# EAGLE design Tension-Logger Rev. A (EAGLE 9.6.2)
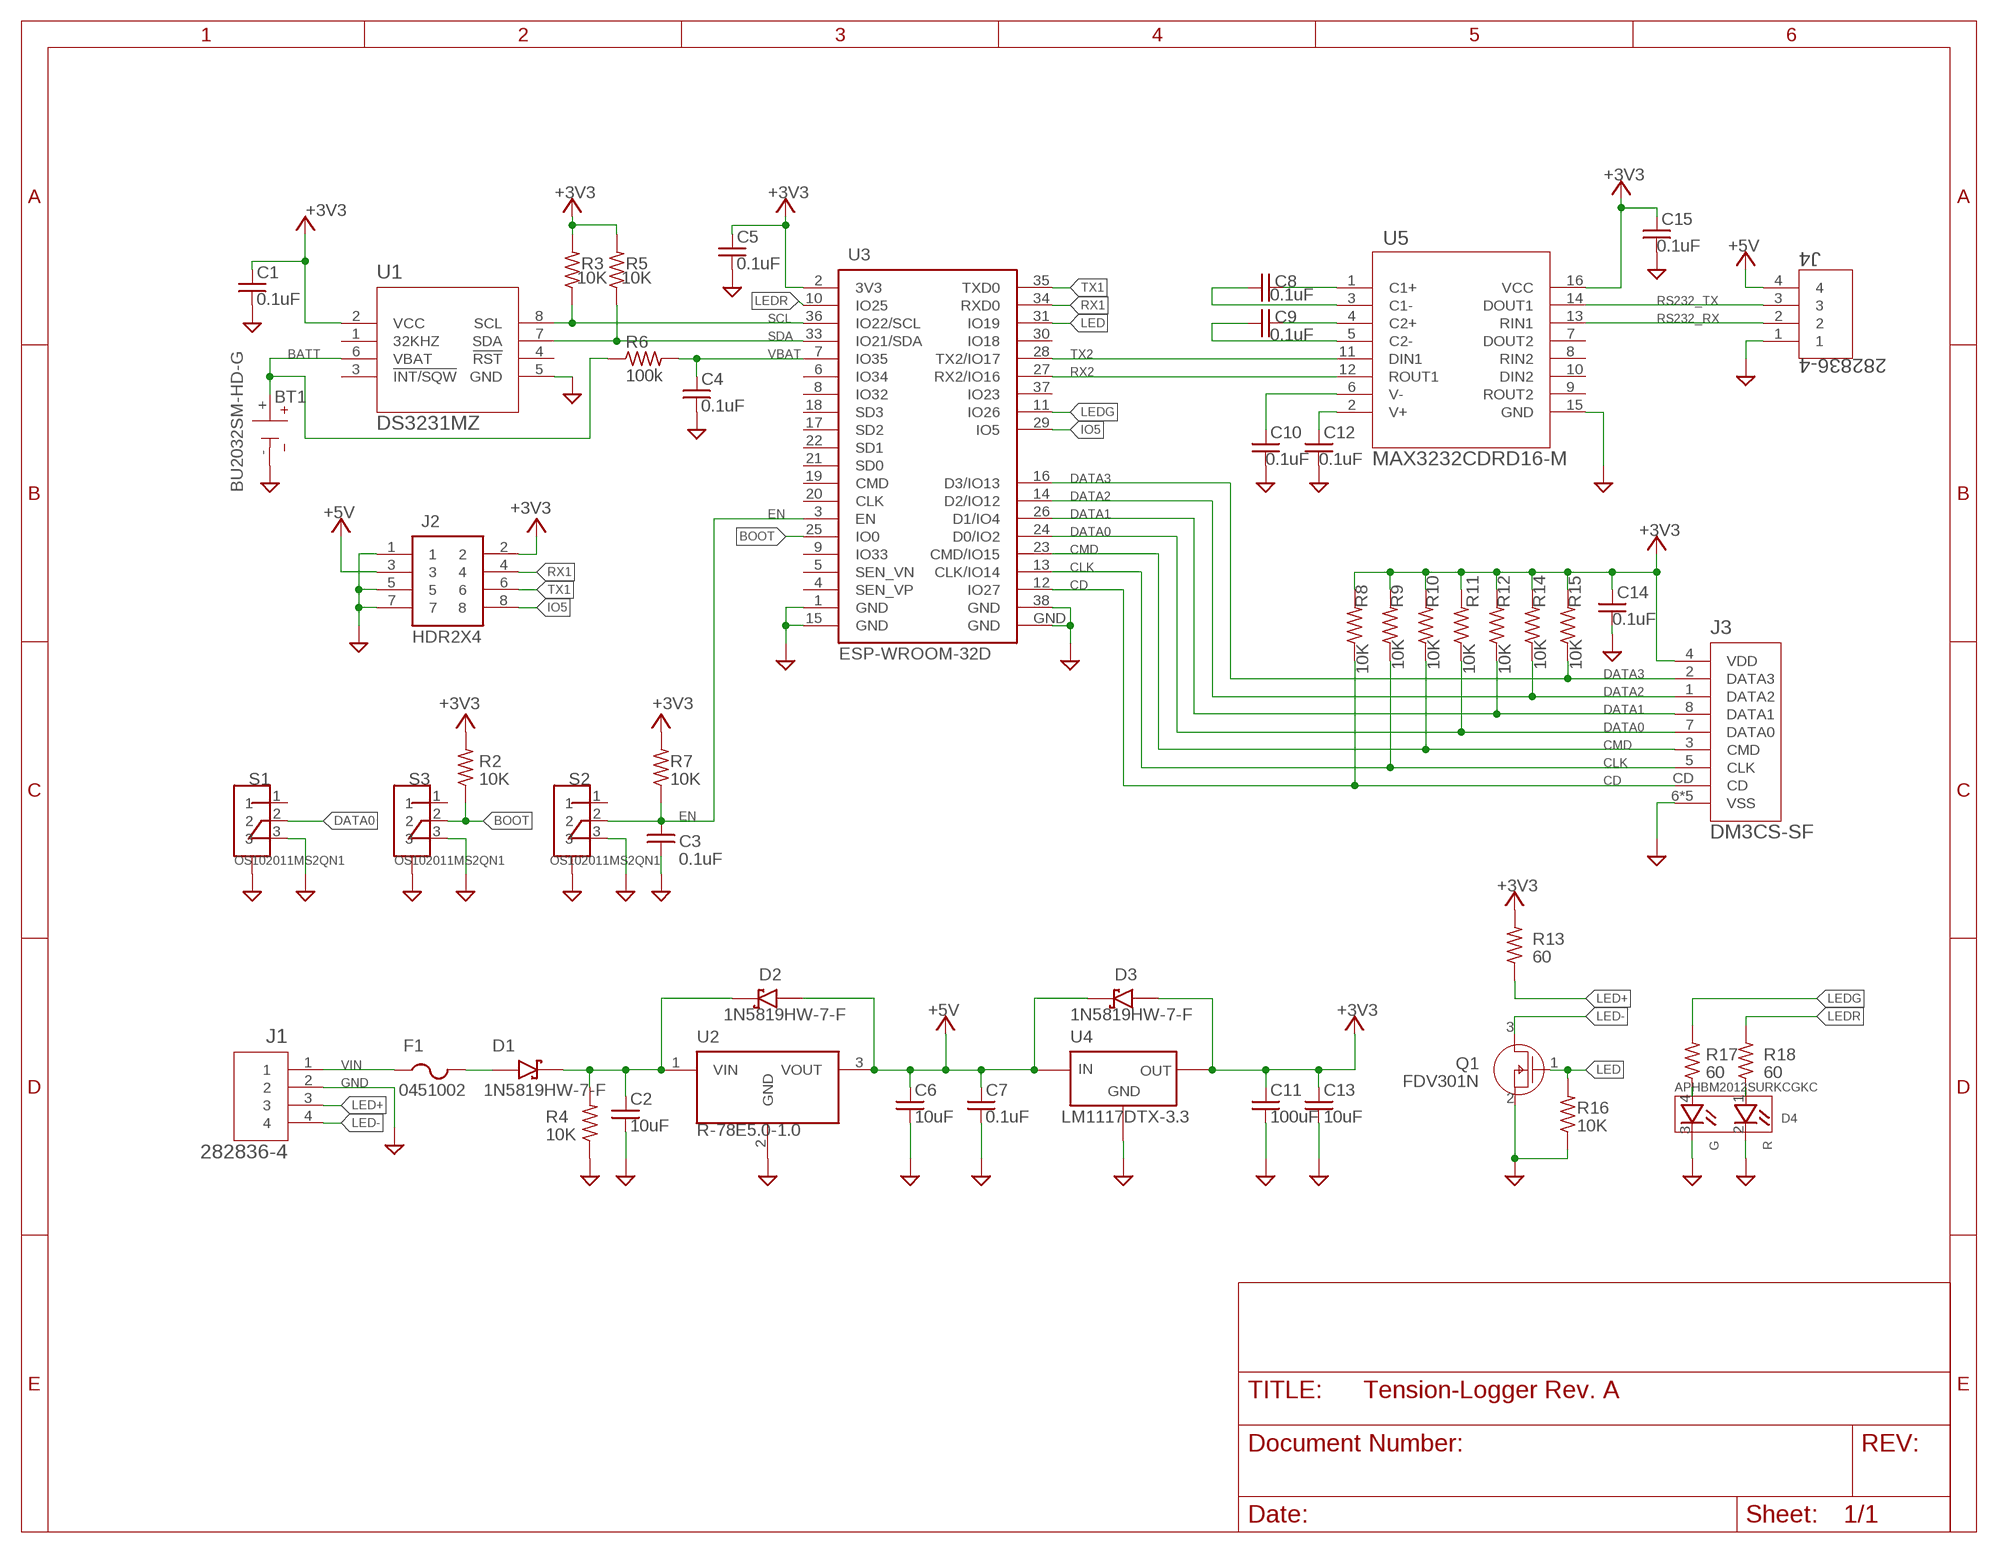
[diagram p0: schematic, sheet 1]

## Parts
BT1  BU2032SM-HD-G  [BAT_BU2032SM-HD-G]
C1  0.1uF  C0805  [0805]
C2  10uF  C0805  [0805]
C3  0.1uF  C0805  [0805]
C4  0.1uF  C0805  [0805]
C5  0.1uF  C0805  [0805]
C6  10uF  C0805  [0805]
C7  0.1uF  C0805  [0805]
C8  0.1uF  C0805  [0805]
C9  0.1uF  C0805  [0805]
C10  0.1uF  C0805  [0805]
C11  100uF  C1210  [1210]
C12  0.1uF  C0805  [0805]
C13  10uF  C1210  [1210]
C14  0.1uF  C0805  [0805]
C15  0.1uF  C0805  [0805]
D1  1N5819HW-7-F  [SOD3715X145N]
D2  1N5819HW-7-F  [SOD3715X145N]
D3  1N5819HW-7-F  [SOD3715X145N]
D4  APHBM2012SURKCGKC  [LED_APHBM2012SURKCGKC]
F1  0451002  0451002_MRL6.1_2.69_2.69MM  [FUSC6131X270]
J1  282836-4  [282836-4_TYC]
J2  HDR2X4  [HDR2X4]
J3  DM3CS-SF  [CONN_3CS-SF]
J4  282836-4  [282836-4_TYC]
Q1  FDV301N  [SOT23-3_ONS]
R2  10K  R-US_R0805  [R0805]
R3  10K  R-US_R0805  [R0805]
R4  10K  R-US_R0805  [R0805]
R5  10K  R-US_R0805  [R0805]
R6  100k  R-US_R0805  [R0805]
R7  10K  R-US_R0805  [R0805]
R8  10K  R-US_R0805  [R0805]
R9  10K  R-US_R0805  [R0805]
R10  10K  R-US_R0805  [R0805]
R11  10K  R-US_R0805  [R0805]
R12  10K  R-US_R0805  [R0805]
R13  60  R-US_R0805  [R0805]
R14  10K  R-US_R0805  [R0805]
R15  10K  R-US_R0805  [R0805]
R16  10K  R-US_R0805  [R0805]
R17  60  R-US_R0805  [R0805]
R18  60  R-US_R0805  [R0805]
S1  OS102011MS2QN1  [SW_OS102011MS2QN1]
S2  OS102011MS2QN1  [SW_OS102011MS2QN1]
S3  OS102011MS2QN1  [SW_OS102011MS2QN1]
U1  DS3231MZ  DS3231MZ+21-0041B_8_MXM-M  [21-0041B_8_MXM-M]
U2  R-78E5.0-1.0  [CONV_R-78E5.0-1.0]
U3  ESP-WROOM-32D  ESP-WROOM-32  [ESP-WROOM-32]
U4  LM1117DTX-3.3  [TO252]
U5  MAX3232CDRD16-M  [D16-M]

## Nets
+3V3: C1.B C5.B C11.A C13.A C14.A C15.B D3.A J2.2 J3.4(VDD) R2.2 R3.2 R5.2 R7.2 R8.2 R9.2 R10.2 R11.2 R12.2 R13.2 R14.2 R15.2 U1.2(VCC) U3.2(3V3) U4.TAB(OUT) U5.16(VCC)
+5V: C6.A C7.A D2.A D3.C(K) J2.3 J4.4 U2.3(VOUT) U4.2(IN)
BATT: BT1.+ R6.1 U1.6(VBAT)
BOOT: R2.1 S3.2 U3.25(IO0)
CD: J3.CD R8.1 U3.12(IO27)
CLK: J3.5(CLK) R9.1 U3.13(CLK/IO14)
CMD: J3.3(CMD) R10.1 U3.23(CMD/IO15)
DATA0: J3.7(DATA0) R11.1 S1.2 U3.24(D0/IO2)
DATA1: J3.8(DATA1) R12.1 U3.26(D1/IO4)
DATA2: J3.1(DATA2) R14.1 U3.14(D2/IO12)
DATA3: J3.2(DATA3) R15.1 U3.16(D3/IO13)
EN: C3.B R7.1 S2.2 U3.3(EN)
GND: BT1.- C1.A C2.B C3.A C4.A C5.A C6.B C7.B C10.B C11.B C12.B C13.B C14.B C15.A D4.2(C_R) D4.3(C_G) J1.2 J2.1 J2.5 J2.7 J3.6(VSS) J3.GND-1(VSS) J3.GND-2(VSS) J3.GND-3(VSS) J3.GND-4(VSS) J4.1 Q1.2(S) R4.1 R16.1 S1.3 S1.M1(CASE) S1.M2(CASE) S2.3 S2.M1(CASE) S2.M2(CASE) S3.3 S3.M1(CASE) S3.M2(CASE) U1.5(GND) U2.2(GND) U3.1(GND) U3.15(GND) U3.38(GND) U3.GND U4.1(GND) U5.15(GND)
IO5: J2.8 U3.29(IO5)
LED: Q1.1(G) R16.2 U3.31(IO19)
LED+: J1.3 R13.1
LED-: J1.4 Q1.3(D)
LEDG: R17.2 U3.11(IO26)
LEDR: R18.2 U3.10(IO25)
N$1: D1.A F1.2
N$3: D4.1(A_R) R18.1
N$5: C2.A D1.C(K) D2.C(K) R4.2 U2.1(VIN)
N$6: D4.4(A_G) R17.1
N$9: C8.B U5.1(C1+)
N$10: C8.A U5.3(C1-)
N$11: C9.B U5.4(C2+)
N$12: C9.A U5.5(C2-)
N$13: C12.A U5.2(V+)
N$14: C10.A U5.6(V-)
RS232_RX: J4.2 U5.13(RIN1)
RS232_TX: J4.3 U5.14(DOUT1)
RX1: J2.4 U3.34(RXD0)
RX2: U3.27(RX2/IO16) U5.12(ROUT1)
SCL: R3.1 U1.8(SCL) U3.36(IO22/SCL)
SDA: R5.1 U1.7(SDA) U3.33(IO21/SDA)
TX1: J2.6 U3.35(TXD0)
TX2: U3.28(TX2/IO17) U5.11(DIN1)
VBAT: C4.B R6.2 U3.7(IO35)
VIN: F1.1 J1.1
Unconnected: S1.1 S2.1 S3.1 U1.1(32KHZ) U1.3(!INT/SQW) U1.4(!RST) U3.4(SEN_VP) U3.5(SEN_VN) U3.6(IO34) U3.8(IO32) U3.9(IO33) U3.17(SD2) U3.18(SD3) U3.19(CMD) U3.20(CLK) U3.21(SD0) U3.22(SD1) U3.30(IO18) U3.37(IO23) U5.7(DOUT2) U5.8(RIN2) U5.9(ROUT2) U5.10(DIN2)

## Library data of the parts
BT1 = Underwater-Camera-v2.0:BU2032SM-HD-G: Batt Holder Smt Coin 20mm Tape Check prices <https://pricing.snapeda.com/search/part/BU2032SM-HD-G/?ref=eda>; AVAILABILITY: Warning; DESCRIPTION: BATTERY HOLDER COIN 20MM SMD; MF: MPD (Memory Protection Devices); MP: BU2032SM-HD-G; PACKAGE: None; PRICE: None; PURCHASE-URL: https://pricing.snapeda.com/search/part/BU2032SM-HD-G/?ref=eda
C1-C15 = waterspider:C
D1-D3 = Underwater-Camera-v2.0:1N5819HW-7-F: 1N5819HW Series 40 V 1 A Surface Mount Schottky Barrier Rectifier - SOD-123; DESCRIPTION: Diode Schottky 40V 1A Surface Mount SOD-123; DIGI-KEY_PART_NUMBER: 1N5819HW-FDICT-ND; MF: Diodes Inc.; MP: 1N5819HW-7-F; PACKAGE: SOD-123 Diodes Inc.; PURCHASE-URL: https://pricing.snapeda.com/search/part/1N5819HW-7-F/?ref=eda
D4 = Underwater-Camera-v2.0:APHBM2012SURKCGKC: Green, Red 570nm Green, 630nm Red LED Indication - Discrete 2.1V Green, 1.95V Red 0805 (2012 Metric); DESCRIPTION: Green, Red 570nm Green, 630nm Red LED Indication - Discrete 2.1V Green, 1.95V Red 0805 (2012 Metric); DIGI-KEY_PART_NUMBER: 754-1093-1-ND; MF: Kingbright; MP: APHBM2012SURKCGKC; PACKAGE: 0805 Kingbright; PURCHASE-URL: https://pricing.snapeda.com/search/part/APHBM2012SURKCGKC/?ref=eda
F1 = Underwater-Camera-v2.0:0451002_MRL: 0451002.MRL - Littelfuse Inc.- FUSE BOARD MNT 2A 125VAC/VDC SMD
J1 J4 = Underwater-Camera-v2.0:282836-4; BUILT_BY: EMA_UL_Team; MANUFACTURER_PART_NUMBER: 282836-4; SOURCELIBRARY: Tyco_2012-04-26; VENDOR: TE Connectivity
J2 = Underwater-Camera-v2.0:HDR2X4
J3 = Underwater-Camera-v2.0:DM3CS-SF; BUILT_BY: EMA_Matt; COPYRIGHT: Copyright (C) 2018 Accelerated Designs. All rights reserved; MANUFACTURER_PART_NUMBER: DM3CS-SF; SOURCELIBRARY: Hirose_12_20_2019; VENDOR: Hirose
Q1 = Underwater-Camera-v2.0:FDV301N; BUILT_BY: EMA_Jessica; COPYRIGHT: Copyright (C) 2018 Accelerated Designs. All rights reserved; MANUFACTURER_PART_NUMBER: FDV301N; SOURCELIBRARY: ON_Semiconductor_2019-12-30; VENDOR: ON Semiconductor
R2-R18 = waterspider:R-US_: RESISTOR, American symbol
S1-S3 = Underwater-Camera-v2.0:OS102011MS2QN1: Switch Slide ON ON SPDT Top Slide 0.1A 12VDC 10000Cycles PC Pins Thru-Hole Bulk; DESCRIPTION: SLIDE SWITCH SPDT T/H ON-ON BBM; DIGI-KEY_PART_NUMBER: CKN12284-ND; MF: C&K; MP: OS102011MS2QN1; PACKAGE: None; PURCHASE-URL: https://pricing.snapeda.com/search/part/OS102011MS2QN1/?ref=eda
U1 = Underwater-Camera-v2.0:DS3231MZ+; BUILT_BY: EMA_UL_Team; MANUFACTURER_PART_NUMBER: DS3231MZ+; SOURCELIBRARY: Maxim_2014-05-21; VENDOR: Maxim Integrated Products
U2 = Underwater-Camera-v2.0:R-78E5.0-1.0: 1.0 Amp SIP3 Single Output; DESCRIPTION: 1A DC/DC-Converter 'INNOLINE' SIP3 reg; DIGI-KEY_PART_NUMBER: 945-2201-ND; MF: Recom Power; MP: R-78E5.0-1.0; PACKAGE: SIP-3 Recom Power; PURCHASE-URL: https://pricing.snapeda.com/search/part/R-78E5.0-1.0/?ref=eda
U3 = Underwater-Camera-v2.0:ESP-WROOM-32: Espressif Systems ESP-WROOM-32
U4 = Underwater-Camera-v2.0:LM1117DTX-*
U5 = Underwater-Camera-v2.0:MAX3232CDR; BUILT_BY: EMA_UL_Team; MANUFACTURER_PART_NUMBER: MAX3232CDR; VENDOR: Texas Instruments

## Board
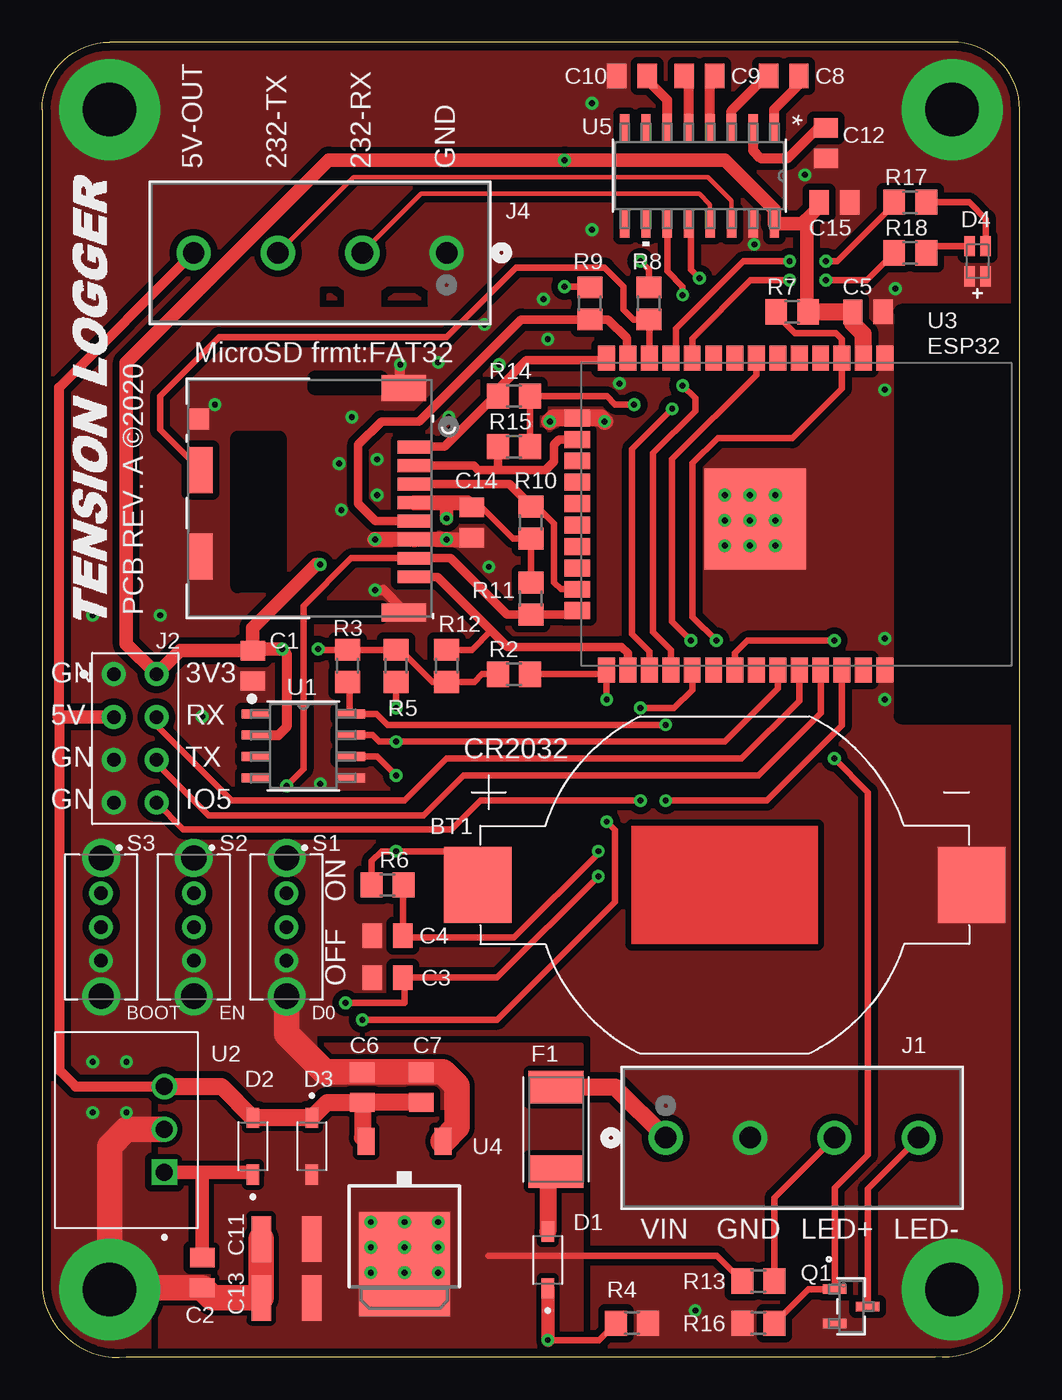
[diagram p1: board, top side]
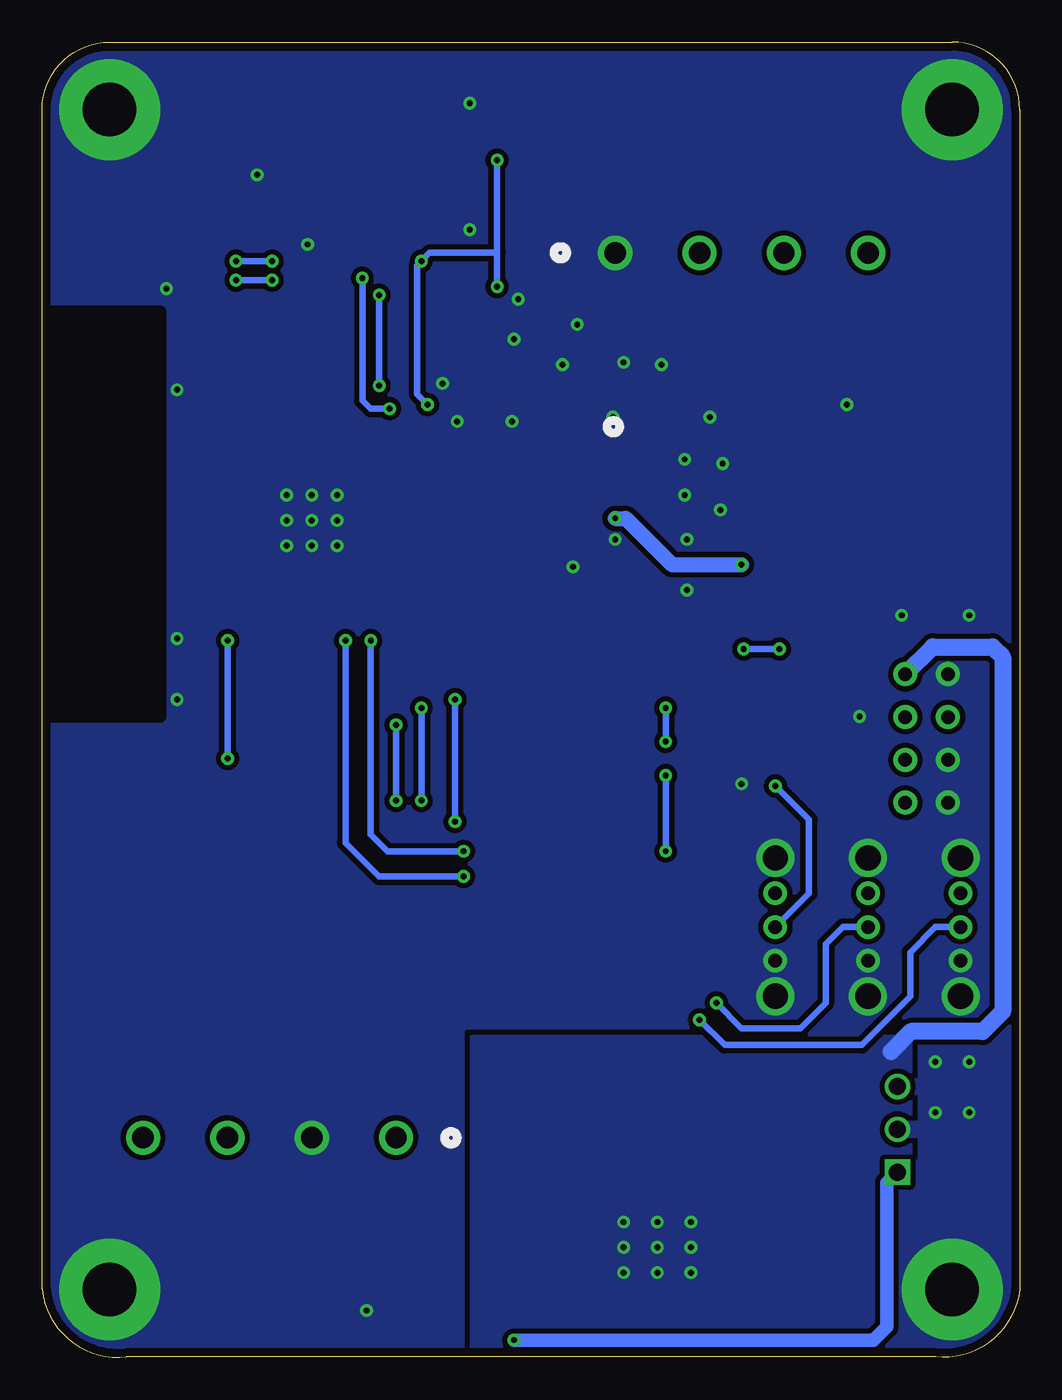
[diagram p2: board, bottom side, seen from below]

Size 58 x 78.03 mm. Coordinates in mm from the lower left corner, seen from the top.
Outline: 54,78.03 4,78.03 arc90 0,74.03 0,4.03 arc90 5,0.03 53,0.03 arc90 58,4.03 58,74.03 arc90 54,78.03
Copper layers (1*16): Top 0.035mm / dielectric 1.5mm / Bottom 0.035mm
Design rules "default *": minimum track width 10mil, minimum drill 0.35mm, track to track 10mil, track to pad 10mil, pad to pad 10mil, via to via 10mil, smd to smd 10mil, copper to edge 20mil, drill to drill 10mil, minimum pad ring 10mil, minimum via ring 8mil, stop-mask expansion 4mil, vias tented up to drill 0.4mm, thermal gap 10mil
tRestrict: area 51,38 to 59.5,62
bRestrict: area 51,38 to 60.5,62

### Footprints (pad centres in the part's own frame; a part is rotated, then mirrored left to right if it is on the bottom)
BAT_BU2032SM-HD-G = smd 4 x 4.5: + -14.65,0; - 14.65,0
0805 = smd 1.15 x 1.45: A -0.9,0; B 0.9,0
1210 = smd 1.15 x 2.7: A -1.5,0; B 1.5,0
SOD3715X145N = smd 1.21 x 0.73: A 1.68,0; C -1.68,0
LED_APHBM2012SURKCGKC = smd 1.2 x 0.6: 1 0.9,0.475; 2 -0.9,0.475; 3 -0.9,-0.475; 4 0.9,-0.475
FUSC6131X270 = smd 1.929 x 3.262: 1 -2.5,0; 2 2.5,0
282836-4_TYC = drill 1.27 pad 2.032: 1 0,0; 2 5.004,0; 3 10.008,0; 4 15.011,0
HDR2X4 = drill 0.8 pad 1.422: 1 0,0; 2 0,2.54; 3 2.54,0; 4 2.54,2.54; 5 5.08,0; 6 5.08,2.54; 7 7.62,0; 8 7.62,2.54
CONN_3CS-SF = smd 0.762 x 2.007: 1 3.041,-6.198; 2 1.941,-6.198; 3 0.841,-6.198; 4 -0.259,-6.198; 5 -1.359,-6.198; 6 -2.459,-6.198; 7 -3.559,-6.198; 8 -4.659,-6.198 | smd 2.743 x 1.448: CD 1.669,6.477; GND-2 -3.459,6.477 | smd 1.041 x 2.642: GND-1 -6.779,-5.578 | smd 1.245 x 1.245: GND-3 4.691,6.579 | smd 1.549 x 2.642: GND-4 6.526,-5.578
SOT23-3_ONS = smd 0.559 x 1.397: 1 -1.016,-0.978; 2 1.016,-0.978; 3 0,0.978
R0805 = smd 1.3 x 1.5: 1 -0.95,0; 2 0.95,0
SW_OS102011MS2QN1 = drill 0.8 pad 1.4: 1 -2,0; 2 0,0; 3 2,0 | drill 1.5 pad 2: M1 -4.1,0; M2 4.1,0
21-0041B_8_MXM-M = smd 1.664 x 0.533: 1 -2.826,1.905; 2 -2.826,0.635; 3 -2.826,-0.635; 4 -2.826,-1.905; 5 2.826,-1.905; 6 2.826,-0.635; 7 2.826,0.635; 8 2.826,1.905
CONV_R-78E5.0-1.0 = drill 1 square: 1 -2.54,-2.25 | drill 1: 2 0,-2.25; 3 2.54,-2.25
ESP-WROOM-32 = smd 1.5 x 1: 1 -9.25,7; 2 -9.25,5.73; 3 -9.25,4.46; 4 -9.25,3.19; 5 -9.25,1.92; 6 -9.25,0.65; 7 -9.25,-0.62; 8 -9.25,-1.89; 9 -9.25,-3.16; 10 -9.25,-4.43; 11 -9.25,-5.7; 12 -9.25,-6.97; 13 -9.25,-8.24; 14 -9.25,-9.51; 25 9.25,-9.51; 26 9.25,-8.24; 27 9.25,-6.97; 28 9.25,-5.7; 29 9.25,-4.43; 30 9.25,-3.16; 31 9.25,-1.89; 32 9.25,-0.62; 33 9.25,0.65; 34 9.25,1.92; 35 9.25,3.19; 36 9.25,4.46; 37 9.25,5.73; 38 9.25,7 | smd 1 x 1.5: 15 -5.7,-11.25; 16 -4.43,-11.25; 17 -3.16,-11.25; 18 -1.89,-11.25; 19 -0.62,-11.25; 20 0.65,-11.25; 21 1.92,-11.25; 22 3.19,-11.25; 23 4.46,-11.25; 24 5.73,-11.25 | smd 6 x 6: GND 0.3,-0.7
TO252 = smd 1 x 1.6: 1 -2.28,-4.8; 2 2.28,-4.8 | smd 5.4 x 6.2: TAB 0,2.5
D16-M = smd 1.664 x 0.559: 1 -2.826,4.445; 2 -2.826,3.175; 3 -2.826,1.905; 4 -2.826,0.635; 5 -2.826,-0.635; 6 -2.826,-1.905; 7 -2.826,-3.175; 8 -2.826,-4.445; 9 2.826,-4.445; 10 2.826,-3.175; 11 2.826,-1.905; 12 2.826,-0.635; 13 2.826,0.635; 14 2.826,1.905; 15 2.826,3.175; 16 2.826,4.445

### Placement (x,y rotation side)
BT1  40.5,28.03 0 top
C1  12.5,41.03 90 top
C2  9.5,5.03 270 top
C3  20.5,22.53 0 top
C4  20.5,25.03 0 top
C5  49,62.03 180 top
C6  19,16.03 90 top
C7  22.5,16.03 90 top
C8  44,76.03 0 top
C9  39,76.03 0 top
C10  35,76.03 180 top
C11  14.5,7.03 180 top
C12  46.5,72.03 270 top
C13  14.5,3.53 180 top
C14  25.5,49.53 270 top
C15  47,68.53 180 top
D1  30,5.78 90 top
D2  12.5,12.53 90 top
D3  16,12.53 270 top
D4  55.5,65.03 90 top
F1  30.5,13.53 270 top
J1  37,13.03 0 top
J2  4.25,40.53 270 top
J3  15.88,50.97 90 top
J4  24,65.53 180 top
Q1  48,3.03 270 top
R2  28,40.53 180 top
R3  18.12,41.03 90 top
R4  35,2.03 180 top
R5  21,41.03 90 top
R6  20.5,28.03 0 top
R7  44.5,62.03 0 top
R8  36,62.53 90 top
R9  32.5,62.53 90 top
R10  29,49.53 270 top
R11  29,45.03 90 top
R12  24,41.03 270 top
R13  42.5,4.53 180 top
R14  28,57.03 0 top
R15  28,54.03 0 top
R16  42.5,2.03 0 top
R17  51.5,68.53 180 top
R18  51.5,65.53 180 top
S1  14.5,25.53 270 top
S2  9,25.53 270 top
S3  3.5,25.53 270 top
U1  15.5,36.28 0 top
U2  5,13.53 90 top
U3  43,50.03 270 top
U4  21.5,8.03 180 top
U5  39,70.1 270 top

### Tracks (layer width: path | path; a pad name or v marks a point on that pad's centre or on a via)
+3V3  (via drill 0.35)
  Top 0.4: R15.2 R14.2 33.5,57.03 34,56.53 v35.12,56.53 | R11.2 R10.2 27.95,48.58 26.1,50.43 C14.A | R9.2 32.45,63.53 v31,63.53 | R8.2 36,64.53 v35.5,65.03 | R2.2 26.09,40.53 25.64,40.08 R12.2 23.17,40.08 21.27,41.98 R5.2 R3.2 16.43,41.98 v16.38,42.03 | R13.2 40.05,6.03 26.5,6.03
  Top 0.6: U1.2 14.02,36.91 14.51,37.4 14.51,41.77 v14.25,42.03
  Top 0.8: 25.22,50.71 C14.A | v24,49.78 24,50.71 | C15.B 46.1,68.24 45.38,67.52 | 45.38,67.52 45.13,67.27 U5.16 43.45,68.08 40.5,71.03 v31,71.03 17,71.03 5,59.03 5,42.32 J2.2 8.19,41.93 C1.B | R7.2 45.38,62.1 45.38,67.52 | v16.5,47.03 16.25,47.03 12.5,43.28 C1.B | C1.B 12.6,42.03 v14.25,42.03
  Top 0.9: J3.4 24,50.71 25.22,50.71
  Top 1: U3.2 48.71,59.29 48.71,60.71 48.1,61.33 C5.B R7.2
  Bottom 0.4: v16.38,42.03 v14.25,42.03 | v31,63.53 31,65.53 | 31,65.53 v31,71.03 | 31,65.53 35,65.53 v35.5,65.03 35.75,64.78 35.75,57.15 v35.12,56.53
  Bottom 0.9: v24,49.78 23.38,49.78 20.62,47.03 v16.5,47.03
  Bottom 1: J2.2 5.16,42.15 1.62,42.15 1.01,41.53 1.01,20.52 2.2,19.32 6.45,19.32 7.62,18.15
  other vias: 23.5,5.03 21.5,5.03 19.5,5.03 19.5,8.03 19.5,6.53 21.5,8.03 21.5,6.53 23.5,6.53 23.5,8.03
  pour Top (isolate 0.3, no thermals): 32,-0.97 32,18.53 7,18.53 7,-0.97
  pour Bottom (isolate 0.3): 6.5,-1.47 6.5,19.03 32.5,19.03 32.5,-1.47
+5V
  Top 0.6: J4.4 1,57.54 1,38.03 1,17.05 1.99,16.07 U2.3
  Top 0.8: J2.3 1.04,37.99 1,38.03
  Top 1: U2.3 10.64,16.07 D2.A D3.C 16.92,15.13 C6.A | U4.2 19,13.05 C6.A | C7.A C6.A
BATT  (via drill 0.35)
  Top 0.4: v21,34.53 19.88,35.64 U1.6 | BT1.+ 25.85,29.28 25.1,30.03 v21,30.03 20.12,30.03 19.55,29.45 R6.1
  Bottom 0.4: v21,34.53 v21,30.03
BOOT  (via drill 0.35)
  Top 0.4: R2.1 33.24,40.53 U3.25 v33.49,39.04 v33.5,39.03 | v19,20.03 27,20.03 34,27.03 34,31.28 v33.5,31.78
  Bottom 0.4: S3.2 5,25.53 6.5,24.03 6.5,21.4 9.38,18.53 17.5,18.53 v19,20.03 | v33.5,31.78 v33.5,39.03
CD
  Top 0.4: J3.CD 7,55.04 7,57.03 10.5,60.53 24,60.53 28.12,64.65 33.38,64.65 34.5,63.53 34.5,62.15 35.08,61.58 R8.1 36.03,61.55 U3.12
CLK
  Top 0.5: J3.5 19.79,49.61 18.75,50.65 18.75,54.15 20.12,55.53 22.38,55.53 28.43,61.58 R9.1 33.58,61.58 34.69,60.46 34.69,59.34 U3.13
CMD
  Top 0.4: U3.23 30.79,45.57 30.38,45.98 30.38,49.48 29.38,50.48 R10.1
  Top 0.5: J3.3 27.72,51.81 29,50.53 R10.1
DATA0  (via drill 0.35)
  Top 0.4: J3.7 18.34,47.41 15.5,44.57 15.5,34.9 v14.5,33.9
  Top 0.5: J3.7 24.24,47.41 27.57,44.08 R11.1 31.28,44.08 31.5,44.3 U3.24
  Bottom 0.4: S1.2 12.5,27.53 12.5,31.9 v14.5,33.9
DATA1
  Top 0.4: 26.64,43.12 25.5,41.98 R12.1
  Top 0.5: J3.8 23.45,46.31 26.64,43.12 27.6,42.15 34.38,42.15 34.76,41.77 U3.26
DATA2
  Top 0.5: J3.1 22.1,54.03 23.88,54.03 26.88,57.03 R14.1 27.05,57.45 28.75,59.15 33.49,59.15 U3.14
DATA3
  Top 0.5: J3.2 25.62,52.91 25.88,52.65 27.12,52.65 | U3.16 30.68,54.46 30.38,54.15 30.38,53.15 29.88,52.65 27.12,52.65 | R15.1 27.05,52.73 27.12,52.65
EN  (via drill 0.35)
  Top 0.4: R7.1 43.55,61.88 44.66,60.78 47.08,60.78 47.46,60.4 U3.3 47.46,57.49 44.5,54.53 40.08,54.53 38.6,53.04 38.6,43.93 v40,42.53 | v33,28.53 27,22.53 21.5,22.53 | 21.5,22.53 C3.B | v18,21.03 21.5,21.03 21.5,22.53
  Bottom 0.4: v40,42.53 40,30.53 38,28.53 v33,28.53 | S2.2 10.5,25.53 11.5,24.53 11.5,21.03 13,19.53 16.5,19.53 v18,21.03
GND  (via drill 0.35, 3.17 pad 6)
  Top 0.6: J3.GND-4 21.25,57.7 v21.25,58.9 | v19.75,45.53 20.25,45.53 21.46,44.32 J3.GND-1
  Top 0.9: 22.06,48.52 v19.75,48.52 v19.75,48.53 | 22.06,48.52 J3.6 | 25.4,48.53 v24,48.53 v24,48.52 22.06,48.52
  Top 1: C14.B 25.4,48.53 | v30.12,55.53 30.32,55.73 U3.15 33.17,55.73 v33.38,55.53
  Top 1.5: C11.B C13.B 10.1,3.53 C2.B 4.1,4.13 | 4.1,4.13 v4,4.03 | U2.2 5,13.53 4,12.53 4,4.23 4.1,4.13 | S1.M2 14.5,19.18 16.75,16.93 C6.B C7.B 23.8,16.93 24.62,16.1 24.62,13.67 U4.1
  other vias: 4,74.03 54,4.03 54,74.03 19.88,51.15 23.5,59.03 17.75,50.28 17.62,53.03 19.88,53.28 18.38,55.78 34.25,57.78 27.12,58.9 30,60.4 24.12,55.78 10.25,56.53 26.25,61.28 50.62,63.4 50,57.4 42.25,66.03 50,42.65 43.5,48.15 43.5,49.65 43.5,51.15 42,51.15 42,49.65 42,48.15 40.5,48.15 40.5,49.65 40.5,51.15 29.75,62.78 5,17.53 38.75,2.78 3,17.53 32.62,66.9 45.25,70.15 32.62,74.4 9.5,38.03 50,39.03 16.5,34.03 3,44.03 7,44.03 26.5,46.9 5,14.53 3,14.53
  pour Bottom (isolate 0.3, rank 2, no thermals): 0,0.03 58,0.03 58,78.03 0,78.03
  pour Top (isolate 0.4, rank 2, no thermals): -0.5,-0.47 58.5,-0.47 58.5,78.53 -0.5,78.53
IO5  (via drill 0.35)
  Top 0.4: J2.8 8.37,31.33 24.3,31.33 26,33.03 v35.5,33.03 | U3.29 38.57,39.6 37.5,38.53 v35.5,38.53
  Bottom 0.4: v35.5,38.53 v35.5,33.03
ISO
  pour Top (isolate 2, no thermals): 17,41.03 17,63.03 35.5,63.03 35.5,41.03
LED  (via drill 0.35)
  Top 0.4: R16.2 45.47,4.04 Q1.1 47.02,10.05 49,12.03 49,33.53 v47,35.53 | U3.31 41.11,41.78 41.86,42.53 v47,42.53
  Bottom 0.4: v47,35.53 v47,42.53
LED+
  Top 0.4: J1.3 43.45,9.47 R13.1
LED-
  Top 0.4: J1.4 48.98,9.99 Q1.3
LEDG  (via drill 0.35)
  Top 0.4: U3.11 37.62,59.59 37.62,61.03 41.61,65.03 v44.35,65.03 | R17.2 50.55,68.4 47.17,65.03 v46.5,65.03
  Bottom 0.4: v46.5,65.03 v44.35,65.03
LEDR  (via drill 0.35)
  Top 0.4: U3.10 38.57,60.44 42.03,63.9 v44.35,63.9 | R18.2 48.92,63.9 v46.5,63.9
  Bottom 0.4: v46.5,63.9 v44.35,63.9
N$1
  Top 1: F1.2 30,10.53 D1.A
N$3
  Top 0.4: D4.1 52.85,65.93 R18.1
N$5  (via drill 0.35)
  Top 0.4: R4.2 33.05,1.03 v30,1.03
  Top 0.8: D1.C v30,1.03 | D2.C 12.36,10.99 9.5,10.99 | 9.5,10.99 U2.1 | C2.A 9.5,10.99
  Bottom 0.8: v30,1.03 8.67,1.03 7.88,1.82 7.88,10.36 U2.1
N$6
  Top 0.4: R17.1 55,68.53 56,67.53 56,65.95 D4.4
N$9
  Top 0.6: U5.1 43.45,74.05 44.9,75.5 C8.B
N$10
  Top 0.6: U5.3 40.91,73.96 42.98,76.03 C8.A
N$11
  Top 0.6: U5.4 39.63,75.76 C9.B
N$12
  Top 0.6: U5.5 38.37,75.76 C9.A
N$13
  Top 0.6: U5.2 42.17,71.6 42.62,71.15 44.25,71.15 46.02,72.93 C12.A
N$14
  Top 0.6: U5.6 37.09,74.58 35.9,75.78 C10.A
RS232_RX
  Top 0.254: U5.13 39.63,68.39 39,69.03 22.5,69.03 J4.2
RS232_TX
  Top 0.254: U5.14 40.91,68.62 39.5,70.03 18.49,70.03 J4.3
RX1
  Top 0.4: U3.34 44.92,38.95 41.5,35.53 24,35.53 21.5,33.03 11.25,33.03 6.79,37.49 J2.4
RX2  (via drill 0.35)
  Top 0.4: U5.12 38.5,67.14 38.5,64.53 v39,64.03 | v37.38,56.28 35,53.89 35,42.9 36.03,41.87 U3.27
  Bottom 0.4: v37.38,56.28 38.51,56.28 39,56.77 v39,64.03
SCL  (via drill 0.35)
  Top 0.4: U3.36 47.46,37.49 43,33.03 v37,33.03 | R3.1 18.25,39.95 18.25,38.26 U1.8 19.84,38.18 20.5,37.53 v37,37.53
  Bottom 0.4: v37,37.53 v37,33.03
SDA  (via drill 0.35)
  Top 0.4: U3.33 43.65,39.68 40.5,36.53 v21,36.53 20,36.53 19.62,36.91 U1.7 | R5.1 v21,38.53
  Bottom 0.4: v21,38.53 v21,36.53
TX1
  Top 0.4: U3.35 46.19,38.22 42.5,34.53 25,34.53 22.62,32.15 9.88,32.15 6.79,35.24 J2.6
TX2  (via drill 0.35)
  Top 0.4: U5.11 37.09,64.43 38,63.53 v38,63.03 | v38,57.65 38.75,56.9 38.75,56.15 36.25,53.65 36.25,43.03 37.3,41.98 U3.28
  Bottom 0.4: v38,63.03 v38,57.65
VBAT  (via drill 0.35)
  Top 0.4: v38.5,42.53 37.38,43.65 37.38,53.28 42.38,58.28 U3.7 | R6.2 21.4,27.98 C4.B 21.52,24.9 28,24.9 33,29.9 v33,30.03
  Bottom 0.4: v38.5,42.53 38.5,31.03 37.5,30.03 v33,30.03
VIN
  Top 1: J1.1 34,16.03 F1.1

### Text on the board
tPlace: 5V-OUT | 232-TX | 232-RX | GND | MicroSD frmt:FAT32 | U3 / ESP32 | PCB REV. A ©2020 | GN | 3V3 | 5V | RX | GN | TX | CR2032 | GN | IO5 | ON | OFF | BOOT | EN | D0 | VIN | GND | LED+ | LED-